# EAGLE design RFM12B_Breakout (EAGLE 6.2)
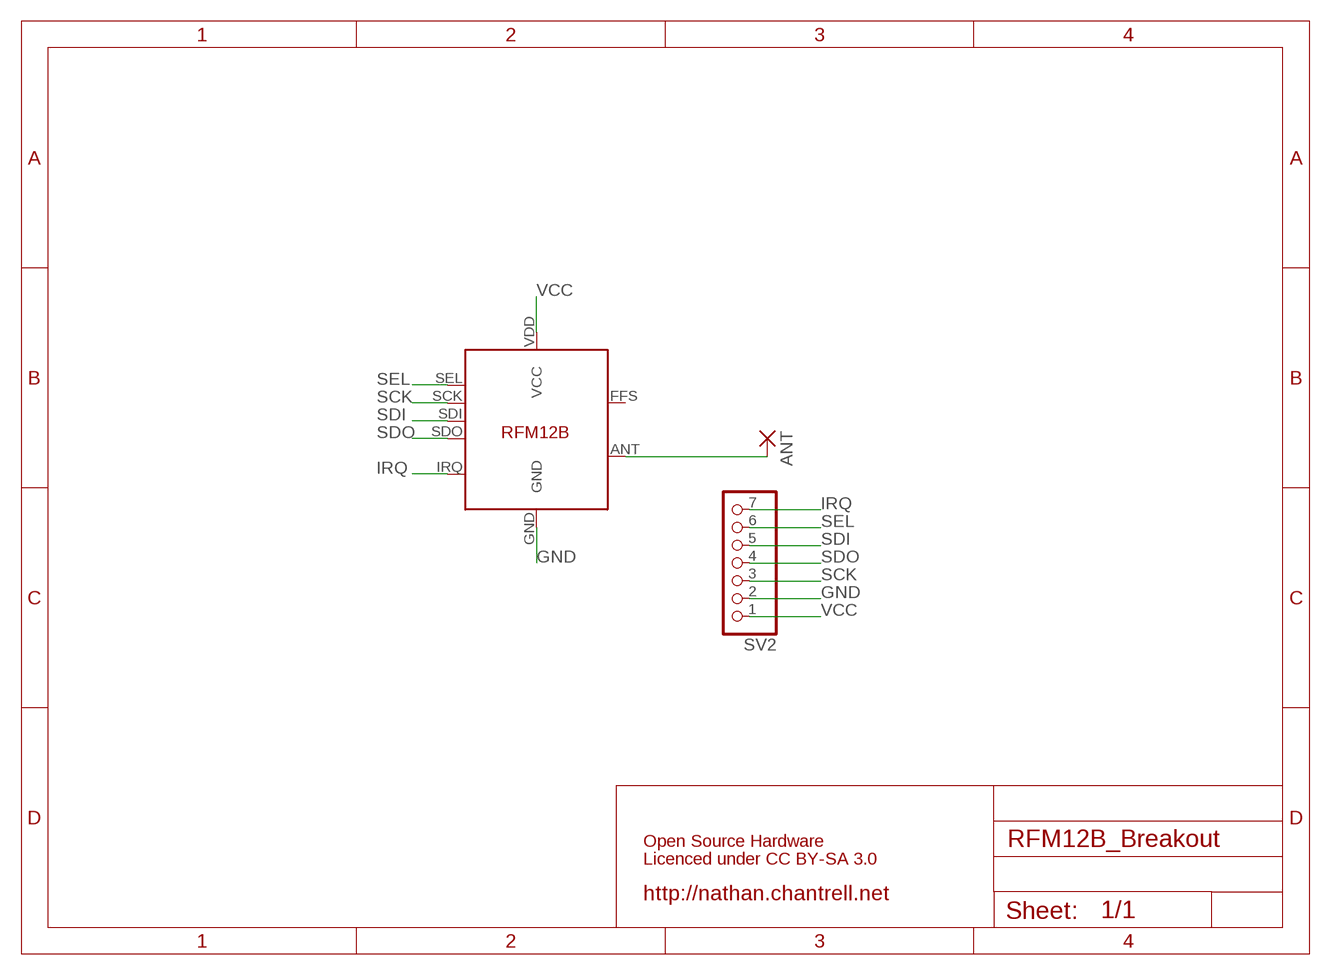
[diagram p0: schematic, sheet 1]

## Parts
ANT  1,6/0,8  [1,6/0,8]
SV2  PINHD-1X7  [1X07]
U$1  RFM12B  [RFM12B]

## Nets
GND: SV2.2 U$1.GND
IRQ: SV2.7 U$1.IRQ
N$1: ANT.1(P) U$1.ANT
SCK: SV2.3 U$1.SCK
SDI: SV2.5 U$1.SDI
SDO: SV2.4 U$1.SDO
SEL: SV2.6 U$1.SEL
VCC: SV2.1 U$1.VDD(VCC)
Unconnected: U$1.FFS

## Notes on the sheet
- Open Source Hardware
- Licenced under CC BY-SA 3.0
- http://nathan.chantrell.net

## Library data of the parts
ANT = wirepad:1,6/0,8: THROUGH-HOLE PAD
SV2 = pinhead:PINHD-1X7: PIN HEADER
U$1 = JeeParts:RFM12B

## Board
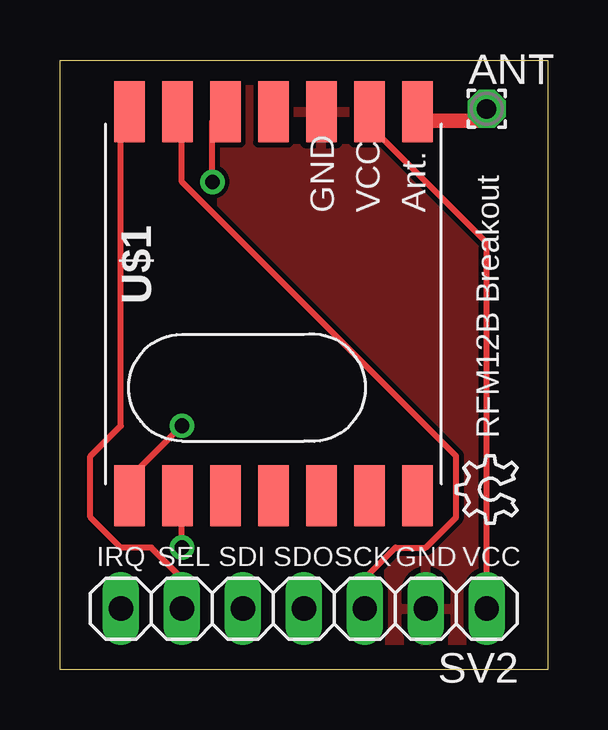
[diagram p1: board, top side]
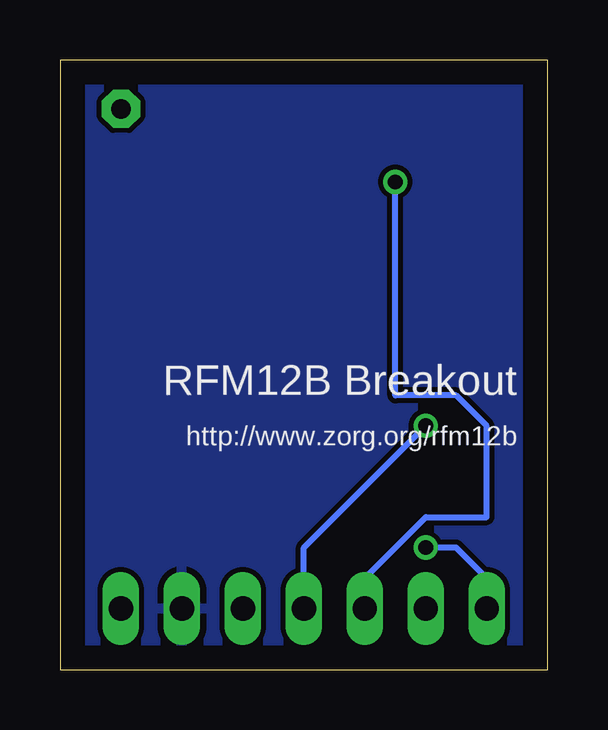
[diagram p2: board, bottom side, seen from below]

Size 20.32 x 25.4 mm. Coordinates in mm from the lower left corner, seen from the top.
Outline: 20.32,25.4 20.32,0 0,0 0,25.4 20.32,25.4
Copper layers (1*16): Top 0.035mm / dielectric 1.5mm / Bottom 0.035mm
Design rules: minimum track width 10mil, minimum drill 24mil, track to track 8mil, track to pad 8mil, pad to pad 8mil, via to via 8mil, smd to smd 8mil, copper to edge 40mil, drill to drill 8mil, minimum pad ring 10mil, minimum via ring 8mil, stop-mask expansion 4mil, vias tented up to drill 0mil, thermal gap 10mil

### Footprints (pad centres in the part's own frame; a part is rotated, then mirrored left to right if it is on the bottom)
1,6/0,8 = drill 0.813 pad 1.6 octagon: 1 0,0
1X07 = drill 1.016 long: 1 -7.62,0; 2 -5.08,0; 3 -2.54,0; 4 0,0; 5 2.54,0; 6 5.08,0; 7 7.62,0
RFM12B = smd 2.54 x 1.27: ANT 8,-6; FFS -8,2; GND 8,-2; IRQ -8,4; P$8 -8,0; P$9 -8,-2; P$10 -8,-4; P$12 -8,-6; P$16 8,0; SCK 8,4; SDI 8,2; SDO -8,6; SEL 8,6; VDD 8,-4

### Placement (x,y rotation side)
ANT  17.78,23.37 0 top
SV2  10.16,2.54 180 top
U$1  8.89,15.24 90 top
U$4  [OSHW_6X100_NOTEXT]  19.05,6.1 90 top

### Tracks (layer width: path | path; a pad name or v marks a point on that pad's centre or on a via)
GND
  pour Bottom: 20.32,25.4 20.32,0 0,0 0,25.4
  pour Top: 20.32,25.4 20.32,0 0,0 0,25.4
IRQ  (via drill 0.61)
  Top 0.254: v5.08,5.08 5.08,6.35 U$1.IRQ
  Bottom 0.254: v5.08,5.08 3.81,5.08 2.54,3.81 SV2.7
N$1
  Top 0.254: 15.24,22.86 U$1.ANT | 17.78,22.86 ANT.1
  Top 0.61: 17.78,22.86 15.24,22.86
SCK
  Top 0.254: SV2.3 12.7,3.81 13.97,5.08 15.24,5.08 16.51,6.35 16.51,8.89 5.08,20.32 5.08,22.86 U$1.SCK
SDI  (via drill 0.61)
  Top 0.254: v6.35,20.32 6.35,22.86 U$1.SDI
  Bottom 0.254: v6.35,20.32 6.35,11.43 3.81,11.43 2.54,10.16 2.54,6.35 5.08,6.35 7.62,3.81 SV2.5
SDO  (via drill 0.61)
  Top 0.254: v5.08,10.16 2.54,7.62 U$1.SDO
  Bottom 0.254: v5.08,10.16 10.16,5.08 SV2.4
SEL
  Top 0.254: SV2.6 5.08,3.81 3.81,5.08 2.54,5.08 1.27,6.35 1.27,8.89 2.54,10.16 2.54,22.86 U$1.SEL
VCC
  Top 0.254: SV2.1 17.78,17.78 12.7,22.86 U$1.VDD

### Text on the board
_tsilk: RFM12B Breakout | IRQ | SEL | SDI | SDO | SCK | GND | VCC
_bsilk: RFM12B Breakout | http://www.zorg.org/rfm12b